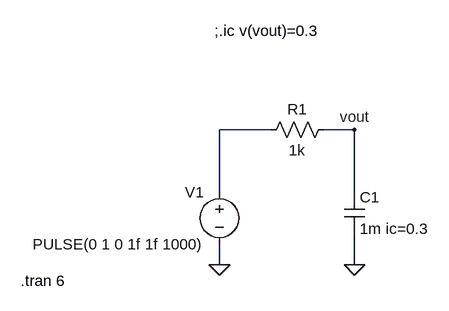
[diagram p0: schematic 03-rc_escalon_con_condiciones_iniciales.asc]
03-rc_escalon_con_condiciones_iniciales.asc, the LTspice schematic file:
Version 4
SHEET 1 880 680
WIRE 160 112 80 112
WIRE 288 112 240 112
WIRE 80 208 80 112
WIRE 288 208 288 112
WIRE 80 320 80 288
WIRE 288 320 288 272
FLAG 288 320 0
FLAG 80 320 0
FLAG 288 112 vout
SYMBOL res 256 96 R90
WINDOW 0 0 56 VBottom 2
WINDOW 3 32 56 VTop 2
SYMATTR InstName R1
SYMATTR Value 1k
SYMBOL cap 272 208 R0
SYMATTR InstName C1
SYMATTR Value 1m ic=0.3
SYMBOL voltage 80 192 M0
WINDOW 123 0 0 Left 0
WINDOW 39 0 0 Left 0
SYMATTR InstName V1
SYMATTR Value PULSE(0 1 0 1f 1f 1000)
TEXT -226 344 Left 2 !.tran 6
TEXT 72 -40 Left 2 !;.ic v(vout)=0.3

The netlist it stands for:
* 03-rc_escalon_con_condiciones_iniciales.asc
R1 vout N001 1k
C1 vout 0 1m ic=0.3
V1 N001 0 PULSE(0 1 0 1f 1f 1000)
.tran 6
;.ic v(vout)=0.3
.backanno
.end